# EAGLE schematic firefly-ice (EAGLE 6.4)

## Sheet 1 of 6
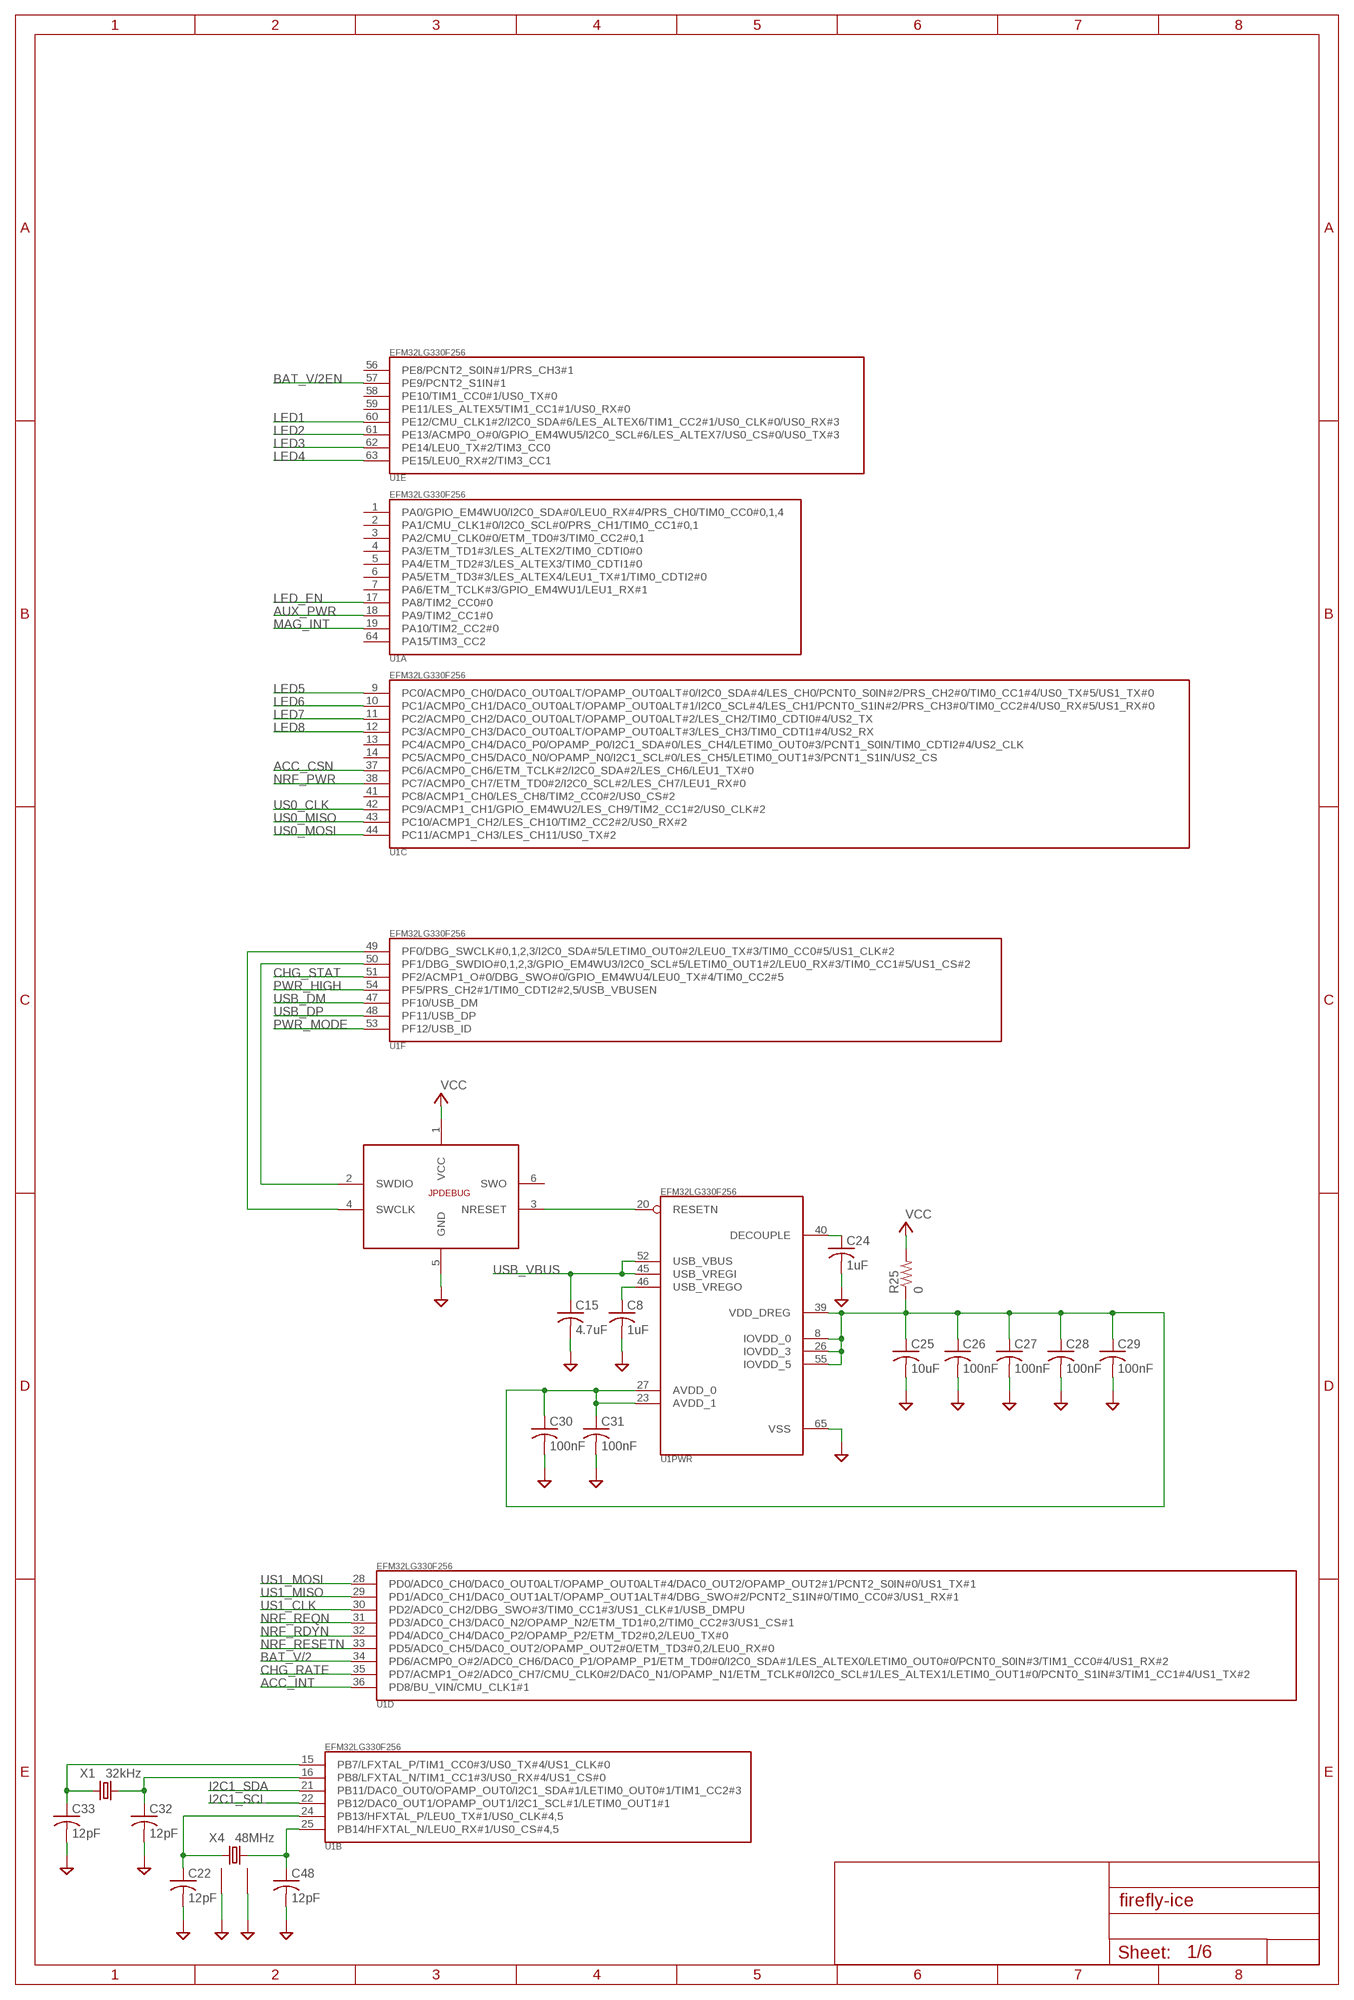
[diagram p0: schematic, sheet 1]

### Parts
C8  1uF  C-USC0201  [C0201]
C15  4.7uF  C-USC0402  [C0402]
C22  12pF  C-USC0201  [C0201]
C24  1uF  C-USC0201  [C0201]
C25  10uF  C-USC0402  [C0402]
C26  100nF  C-USC0201  [C0201]
C27  100nF  C-USC0201  [C0201]
C28  100nF  C-USC0201  [C0201]
C29  100nF  C-USC0201  [C0201]
C30  100nF  C-USC0201  [C0201]
C31  100nF  C-USC0201  [C0201]
C32  12pF  C-USC0201  [C0201]
C33  12pF  C-USC0201  [C0201]
C48  12pF  C-USC0201  [C0201]
JPDEBUG  TC2030-SWD  [TC2030-MCP-NL]
R25  0  R-US_R0603  [R0603@1]
U1  EFM32LG330F256  [QFN64]
X1  32kHz  XTAL29HT10  [9HT10]
X4  48MHz  XTALABM11  [ABM11]

### Nets
ACC_CSN: U1.37(C:PC6/ACMP0_CH6/ETM_TCLK#2/I2C0_SDA#2/LES_CH6/LEU1_TX#0) ; also sheet 3
ACC_INT: U1.36(D:PD8/BU_VIN/CMU_CLK1#1) ; also sheet 3
AUX_PWR: U1.18(A:PA9/TIM2_CC1#0) ; also sheet 4
BAT_V/2: U1.34(D:PD6/ACMP0_O#2/ADC0_CH6/DAC0_P1/OPAMP_P1/ETM_TD0#0/I2C0_SDA#1/LES_ALTEX0/LETIM0_OUT0#0/PCNT0_S0IN#3/TIM1_CC0#4/US1_RX#2) ; also sheet 6
BAT_V/2EN: U1.57(E:PE9/PCNT2_S1IN#1) ; also sheet 6
CHG_RATE: U1.35(D:PD7/ACMP1_O#2/ADC0_CH7/CMU_CLK0#2/DAC0_N1/OPAMP_N1/ETM_TCLK#0/I2C0_SCL#1/LES_ALTEX1/LETIM0_OUT1#0/PCNT0_S1IN#3/TIM1_CC1#4/US1_TX#2) ; also sheet 6
CHG_STAT: U1.51(F:PF2/ACMP1_O#0/DBG_SWO#0/GPIO_EM4WU4/LEU0_TX#4/TIM0_CC2#5) ; also sheet 6
GND: C8.2 C15.2 C22.2 C24.2 C25.2 C26.2 C27.2 C28.2 C29.2 C30.2 C31.2 C32.2 C33.2 C48.2 JPDEBUG.5(GND) U1.65(PWR:VSS) X4.2(GND1) X4.4(GND2) ; also sheet 2,3,4,5,6
I2C1_SCL: U1.22(B:PB12/DAC0_OUT1/OPAMP_OUT1/I2C1_SCL#1/LETIM0_OUT1#1) ; also sheet 4,5
I2C1_SDA: U1.21(B:PB11/DAC0_OUT0/OPAMP_OUT0/I2C1_SDA#1/LETIM0_OUT0#1/TIM1_CC2#3) ; also sheet 4,5
LED1: U1.60(E:PE12/CMU_CLK1#2/I2C0_SDA#6/LES_ALTEX6/TIM1_CC2#1/US0_CLK#0/US0_RX#3) ; also sheet 5
LED2: U1.61(E:PE13/ACMP0_O#0/GPIO_EM4WU5/I2C0_SCL#6/LES_ALTEX7/US0_CS#0/US0_TX#3) ; also sheet 5
LED3: U1.62(E:PE14/LEU0_TX#2/TIM3_CC0) ; also sheet 5
LED4: U1.63(E:PE15/LEU0_RX#2/TIM3_CC1) ; also sheet 5
LED5: U1.9(C:PC0/ACMP0_CH0/DAC0_OUT0ALT/OPAMP_OUT0ALT#0/I2C0_SDA#4/LES_CH0/PCNT0_S0IN#2/PRS_CH2#0/TIM0_CC1#4/US0_TX#5/US1_TX#0) ; also sheet 5
LED6: U1.10(C:PC1/ACMP0_CH1/DAC0_OUT0ALT/OPAMP_OUT0ALT#1/I2C0_SCL#4/LES_CH1/PCNT0_S1IN#2/PRS_CH3#0/TIM0_CC2#4/US0_RX#5/US1_RX#0) ; also sheet 5
LED7: U1.11(C:PC2/ACMP0_CH2/DAC0_OUT0ALT/OPAMP_OUT0ALT#2/LES_CH2/TIM0_CDTI0#4/US2_TX) ; also sheet 5
LED8: U1.12(C:PC3/ACMP0_CH3/DAC0_OUT0ALT/OPAMP_OUT0ALT#3/LES_CH3/TIM0_CDTI1#4/US2_RX) ; also sheet 5
LED_EN: U1.17(A:PA8/TIM2_CC0#0) ; also sheet 5
MAG_INT: U1.19(A:PA10/TIM2_CC2#0) ; also sheet 4
N$2: JPDEBUG.3(NRESET) U1.20(PWR:RESETN)
N$7: C8.1 U1.46(PWR:USB_VREGO)
N$21: C48.1 U1.25(B:PB14/HFXTAL_N/LEU0_RX#1/US0_CS#4,5) X4.3
N$23: C24.1 U1.40(PWR:DECOUPLE)
N$25: C33.1 U1.15(B:PB7/LFXTAL_P/TIM1_CC0#3/US0_TX#4/US1_CLK#0) X1.1
N$34: C22.1 U1.24(B:PB13/HFXTAL_P/LEU0_TX#1/US0_CLK#4,5) X4.1
N$35: JPDEBUG.2(SWDIO) U1.50(F:PF1/DBG_SWDIO#0,1,2,3/GPIO_EM4WU3/I2C0_SCL#5/LETIM0_OUT1#2/LEU0_RX#3/TIM0_CC1#5/US1_CS#2)
N$39: JPDEBUG.4(SWCLK) U1.49(F:PF0/DBG_SWCLK#0,1,2,3/I2C0_SDA#5/LETIM0_OUT0#2/LEU0_TX#3/TIM0_CC0#5/US1_CLK#2)
N$40: C32.1 U1.16(B:PB8/LFXTAL_N/TIM1_CC1#3/US0_RX#4/US1_CS#0) X1.2
N$42: C25.1 C26.1 C27.1 C28.1 C29.1 C30.1 C31.1 R25.1 U1.8(PWR:IOVDD_0) U1.23(PWR:AVDD_1) U1.26(PWR:IOVDD_3) U1.27(PWR:AVDD_0) U1.39(PWR:VDD_DREG) U1.55(PWR:IOVDD_5)
NRF_PWR: U1.38(C:PC7/ACMP0_CH7/ETM_TD0#2/I2C0_SCL#2/LES_CH7/LEU1_RX#0) ; also sheet 2
NRF_RDYN: U1.32(D:PD4/ADC0_CH4/DAC0_P2/OPAMP_P2/ETM_TD2#0,2/LEU0_TX#0) ; also sheet 2
NRF_REQN: U1.31(D:PD3/ADC0_CH3/DAC0_N2/OPAMP_N2/ETM_TD1#0,2/TIM0_CC2#3/US1_CS#1) ; also sheet 2
NRF_RESETN: U1.33(D:PD5/ADC0_CH5/DAC0_OUT2/OPAMP_OUT2#0/ETM_TD3#0,2/LEU0_RX#0) ; also sheet 2
PWR_HIGH: U1.54(F:PF5/PRS_CH2#1/TIM0_CDTI2#2,5/USB_VBUSEN) ; also sheet 6
PWR_MODE: U1.53(F:PF12/USB_ID) ; also sheet 6
US0_CLK: U1.42(C:PC9/ACMP1_CH1/GPIO_EM4WU2/LES_CH9/TIM2_CC1#2/US0_CLK#2) ; also sheet 3
US0_MISO: U1.43(C:PC10/ACMP1_CH2/LES_CH10/TIM2_CC2#2/US0_RX#2) ; also sheet 3
US0_MOSI: U1.44(C:PC11/ACMP1_CH3/LES_CH11/US0_TX#2) ; also sheet 3
US1_CLK: U1.30(D:PD2/ADC0_CH2/DBG_SWO#3/TIM0_CC1#3/US1_CLK#1/USB_DMPU) ; also sheet 2
US1_MISO: U1.29(D:PD1/ADC0_CH1/DAC0_OUT1ALT/OPAMP_OUT1ALT#4/DBG_SWO#2/PCNT2_S1IN#0/TIM0_CC0#3/US1_RX#1) ; also sheet 2
US1_MOSI: U1.28(D:PD0/ADC0_CH0/DAC0_OUT0ALT/OPAMP_OUT0ALT#4/DAC0_OUT2/OPAMP_OUT2#1/PCNT2_S0IN#0/US1_TX#1) ; also sheet 2
USB_DM: U1.47(F:PF10/USB_DM) ; also sheet 6
USB_DP: U1.48(F:PF11/USB_DP) ; also sheet 6
USB_VBUS: C15.1 U1.45(PWR:USB_VREGI) U1.52(PWR:USB_VBUS) ; also sheet 6
VCC: JPDEBUG.1(VCC) R25.2 ; also sheet 2,3,4,5,6
Unconnected: JPDEBUG.6(SWO) U1.1(A:PA0/GPIO_EM4WU0/I2C0_SDA#0/LEU0_RX#4/PRS_CH0/TIM0_CC0#0,1,4) U1.2(A:PA1/CMU_CLK1#0/I2C0_SCL#0/PRS_CH1/TIM0_CC1#0,1) U1.3(A:PA2/CMU_CLK0#0/ETM_TD0#3/TIM0_CC2#0,1) U1.4(A:PA3/ETM_TD1#3/LES_ALTEX2/TIM0_CDTI0#0) U1.5(A:PA4/ETM_TD2#3/LES_ALTEX3/TIM0_CDTI1#0) U1.6(A:PA5/ETM_TD3#3/LES_ALTEX4/LEU1_TX#1/TIM0_CDTI2#0) U1.7(A:PA6/ETM_TCLK#3/GPIO_EM4WU1/LEU1_RX#1) U1.13(C:PC4/ACMP0_CH4/DAC0_P0/OPAMP_P0/I2C1_SDA#0/LES_CH4/LETIM0_OUT0#3/PCNT1_S0IN/TIM0_CDTI2#4/US2_CLK) U1.14(C:PC5/ACMP0_CH5/DAC0_N0/OPAMP_N0/I2C1_SCL#0/LES_CH5/LETIM0_OUT1#3/PCNT1_S1IN/US2_CS) U1.41(C:PC8/ACMP1_CH0/LES_CH8/TIM2_CC0#2/US0_CS#2) U1.56(E:PE8/PCNT2_S0IN#1/PRS_CH3#1) U1.58(E:PE10/TIM1_CC0#1/US0_TX#0) U1.59(E:PE11/LES_ALTEX5/TIM1_CC1#1/US0_RX#0) U1.64(A:PA15/TIM3_CC2)

## Sheet 2 of 6
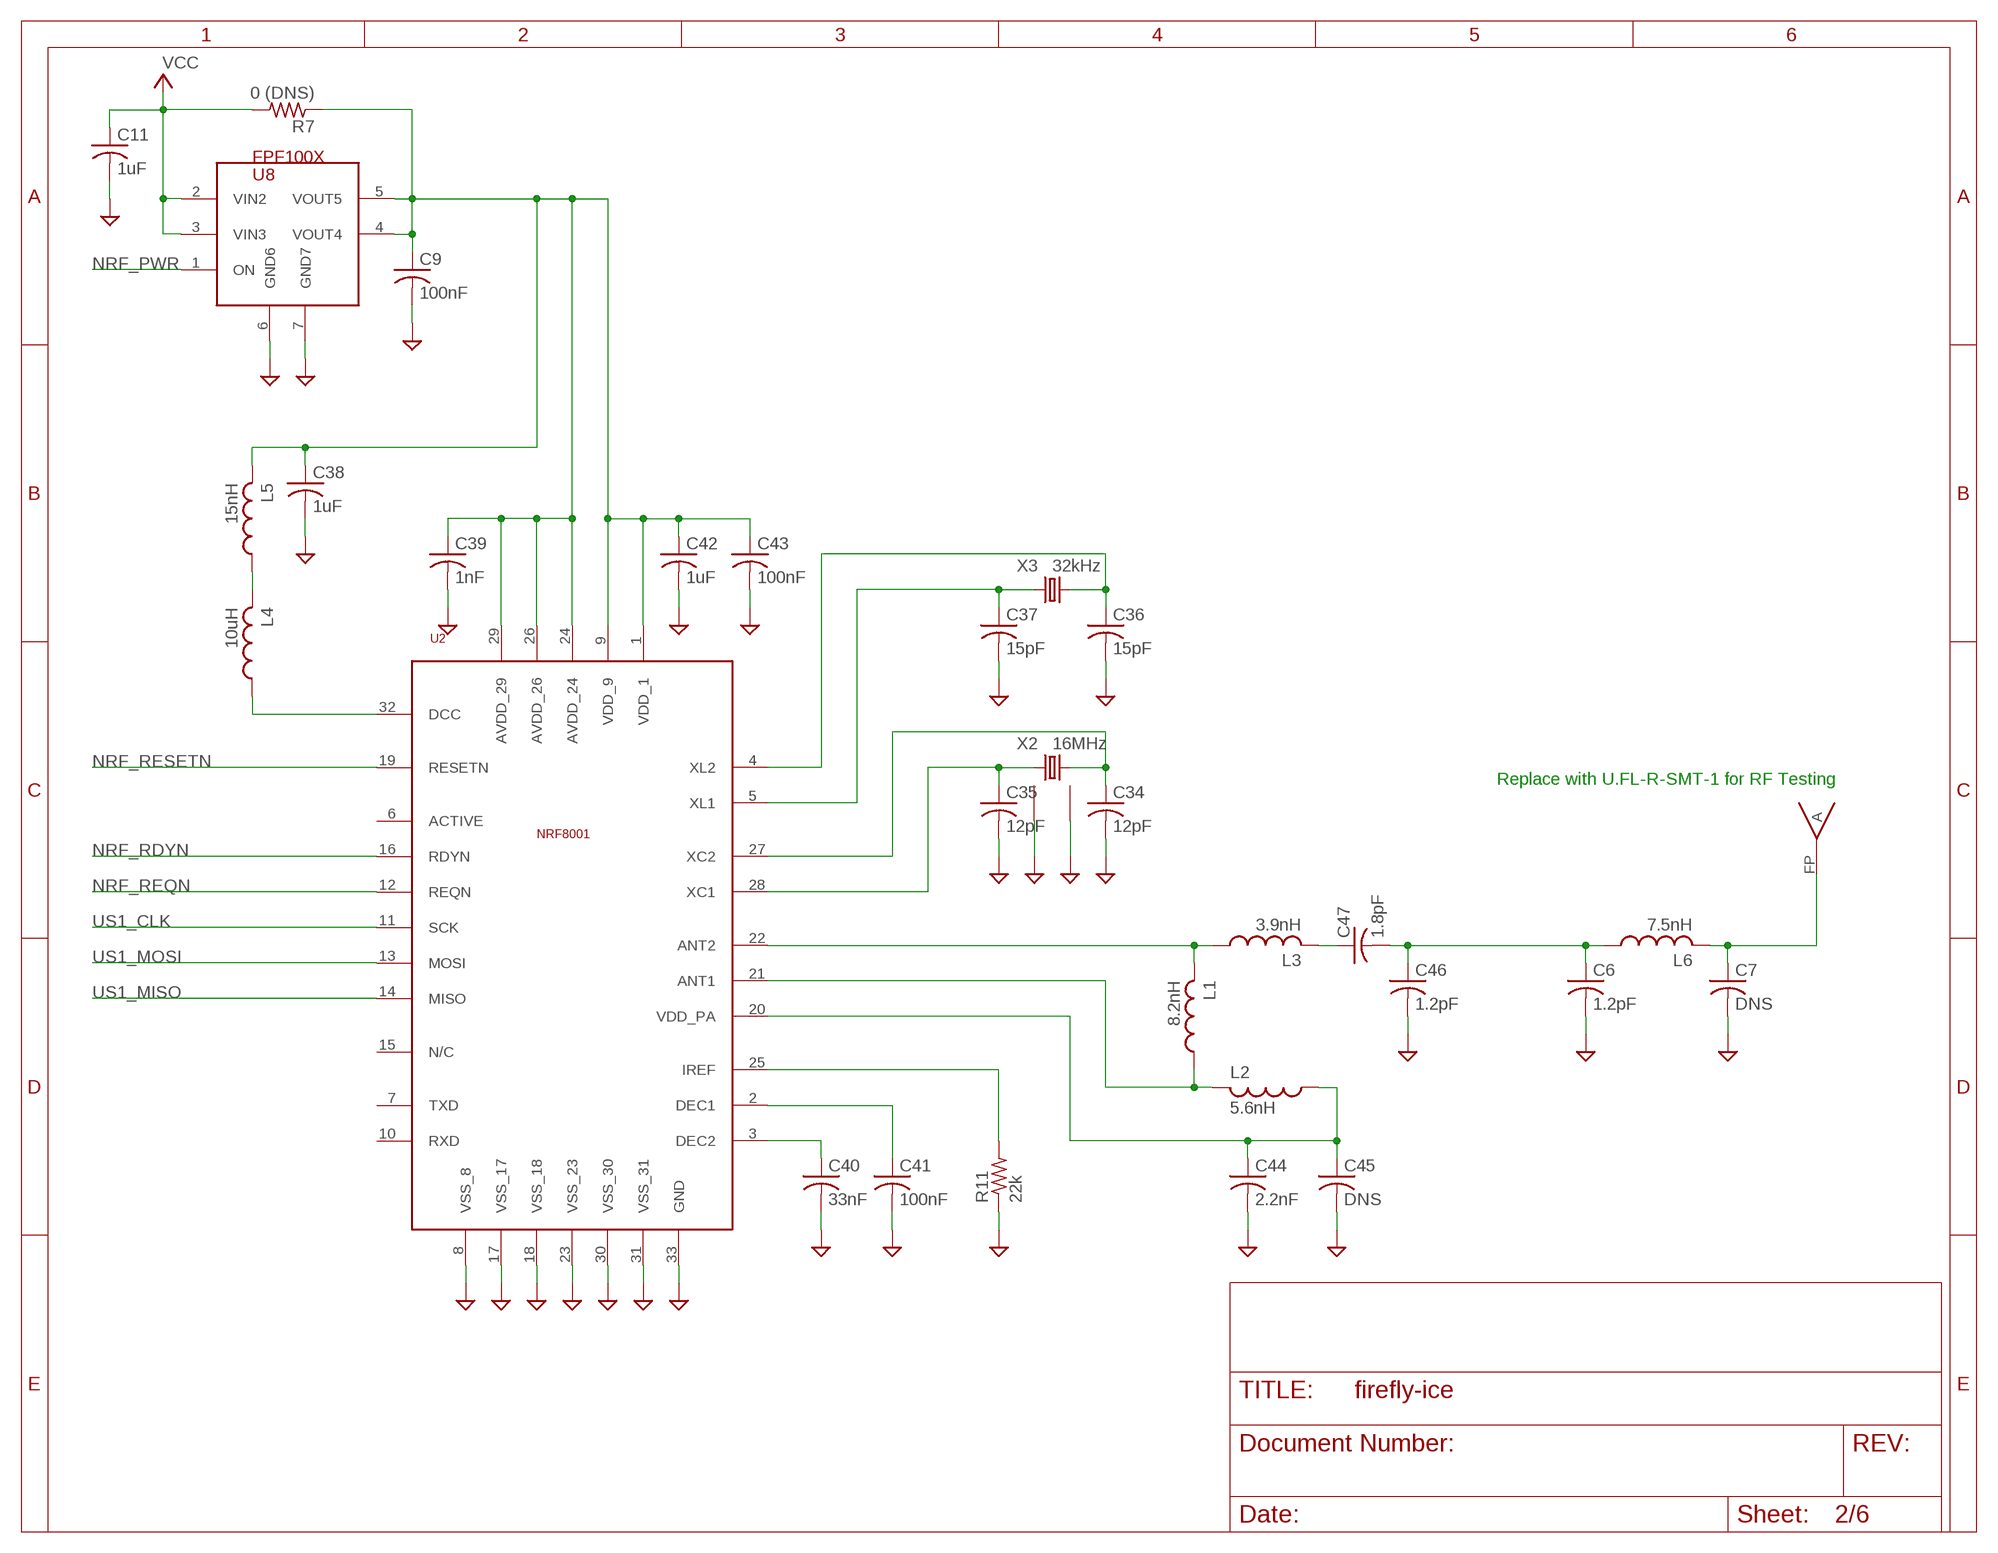
[diagram p1: schematic, sheet 2]

### Parts
A1  FR05_S1_N_0_110  [FR05_S1_N_0_110]
C6  1.2pF  C-USC0201  [C0201]
C7  DNS  C-USC0201  [C0201]
C9  100nF  C-USC0201  [C0201]
C11  1uF  C-USC0201  [C0201]
C34  12pF  C-USC0201  [C0201]
C35  12pF  C-USC0201  [C0201]
C36  15pF  C-USC0201  [C0201]
C37  15pF  C-USC0201  [C0201]
C38  1uF  C-USC0201  [C0201]
C39  1nF  C-USC0201  [C0201]
C40  33nF  C-USC0201  [C0201]
C41  100nF  C-USC0201  [C0201]
C42  1uF  C-USC0201  [C0201]
C43  100nF  C-USC0201  [C0201]
C44  2.2nF  C-USC0201  [C0201]
C45  DNS  C-USC0201  [C0201]
C46  1.2pF  C-USC0201  [C0201]
C47  1.8pF  C-USC0201  [C0201]
L1  8.2nH  L-USL0201  [L0201]
L2  5.6nH  L-USL0201  [L0201]
L3  3.9nH  L-USL0201  [L0201]
L4  10uH  INDUCTOR0603  [0603]
L5  15nH  L-USL0201  [L0201]
L6  7.5nH  L-USL0201  [L0201]
R7  0 (DNS)  R-US_R0201  [R0201]
R11  22k  R-US_R0201  [R0201]
U2  NRF8001  [QFN-32]
U8  FPF100X  [MICROFET-2X2-6L]
X2  16MHz  XTALTSX-3225  [TSX-3225]
X3  32kHz  XTAL29HT10  [9HT10]

### Nets
GND: C6.2 C7.2 C9.2 C11.2 C34.2 C35.2 C36.2 C37.2 C38.2 C39.2 C40.2 C41.2 C42.2 C43.2 C44.2 C45.2 C46.2 R11.1 U2.8(VSS_8) U2.17(VSS_17) U2.18(VSS_18) U2.23(VSS_23) U2.30(VSS_30) U2.31(VSS_31) U2.33(GND) U8.6(GND6) U8.7(GND7) X2.2(GND1) X2.4(GND2) ; also sheet 1,3,4,5,6
N$1: A1.FP(A) C7.1 L6.2
N$8: C9.1 C38.1 C39.1 C42.1 C43.1 L5.2 R7.1 U2.1(VDD_1) U2.9(VDD_9) U2.24(AVDD_24) U2.26(AVDD_26) U2.29(AVDD_29) U8.4(VOUT4) U8.5(VOUT5)
N$16: C35.1 U2.28(XC1) X2.1
N$17: C34.1 U2.27(XC2) X2.3
N$18: C37.1 U2.5(XL1) X3.1
N$27: C36.1 U2.4(XL2) X3.2
N$36: R11.2 U2.25(IREF)
N$43: C40.1 U2.3(DEC2)
N$49: C41.1 U2.2(DEC1)
N$50: C47.1 L3.2
N$51: C6.1 C46.1 C47.2 L6.1
N$52: C44.1 C45.1 L2.1 U2.20(VDD_PA)
N$53: L1.1 L2.2 U2.21(ANT1)
N$54: L1.2 L3.1 U2.22(ANT2)
N$55: L4.1 U2.32(DCC)
N$56: L4.2 L5.1
NRF_PWR: U8.1(ON) ; also sheet 1
NRF_RDYN: U2.16(RDYN) ; also sheet 1
NRF_REQN: U2.12(REQN) ; also sheet 1
NRF_RESETN: U2.19(RESETN) ; also sheet 1
US1_CLK: U2.11(SCK) ; also sheet 1
US1_MISO: U2.14(MISO) ; also sheet 1
US1_MOSI: U2.13(MOSI) ; also sheet 1
VCC: C11.1 R7.2 U8.2(VIN2) U8.3(VIN3) ; also sheet 1,3,4,5,6
Unconnected: U2.6(ACTIVE) U2.7(TXD) U2.10(RXD) U2.15(N/C)

### Notes on the sheet
- Replace with U.FL-R-SMT-1 for RF Testing

## Sheet 3 of 6
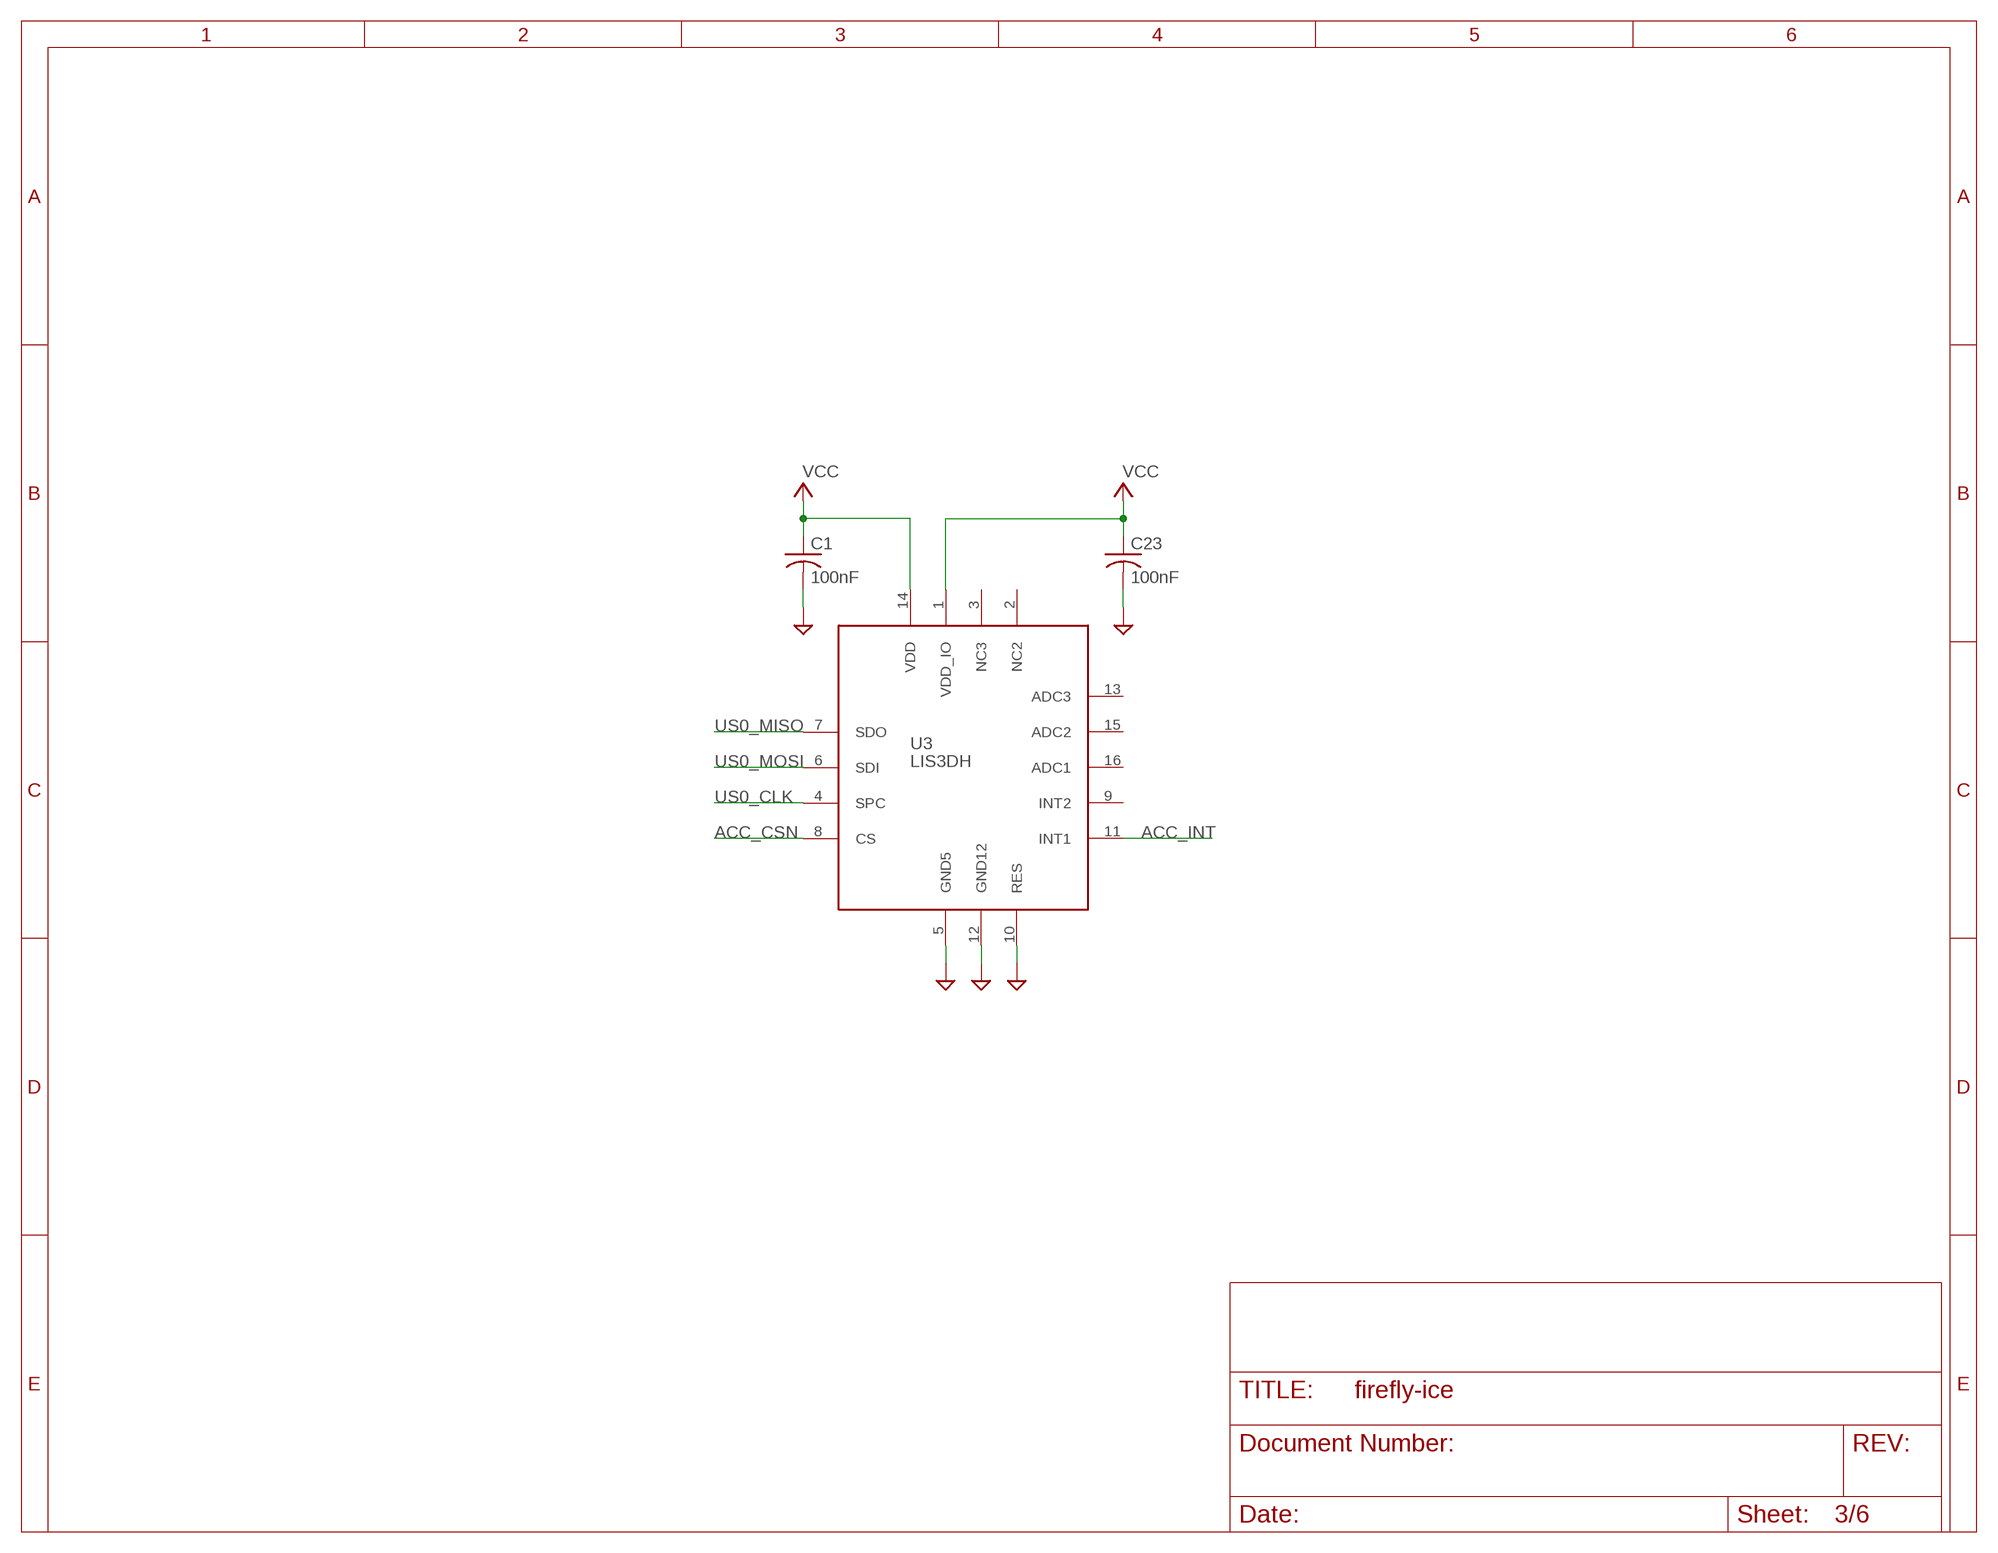
[diagram p2: schematic, sheet 3]

### Parts
C1  100nF  C-USC0201  [C0201]
C23  100nF  C-USC0201  [C0201]
U3  LIS3DH  [LGA16_3X3]

### Nets
ACC_CSN: U3.8(CS) ; also sheet 1
ACC_INT: U3.11(INT1) ; also sheet 1
GND: C1.2 C23.2 U3.5(GND5) U3.10(RES) U3.12(GND12) ; also sheet 1,2,4,5,6
US0_CLK: U3.4(SPC) ; also sheet 1
US0_MISO: U3.7(SDO) ; also sheet 1
US0_MOSI: U3.6(SDI) ; also sheet 1
VCC: C1.1 C23.1 U3.1(VDD_IO) U3.14(VDD) ; also sheet 1,2,4,5,6
Unconnected: U3.2(NC2) U3.3(NC3) U3.9(INT2) U3.13(ADC3) U3.15(ADC2) U3.16(ADC1)

## Sheet 4 of 6
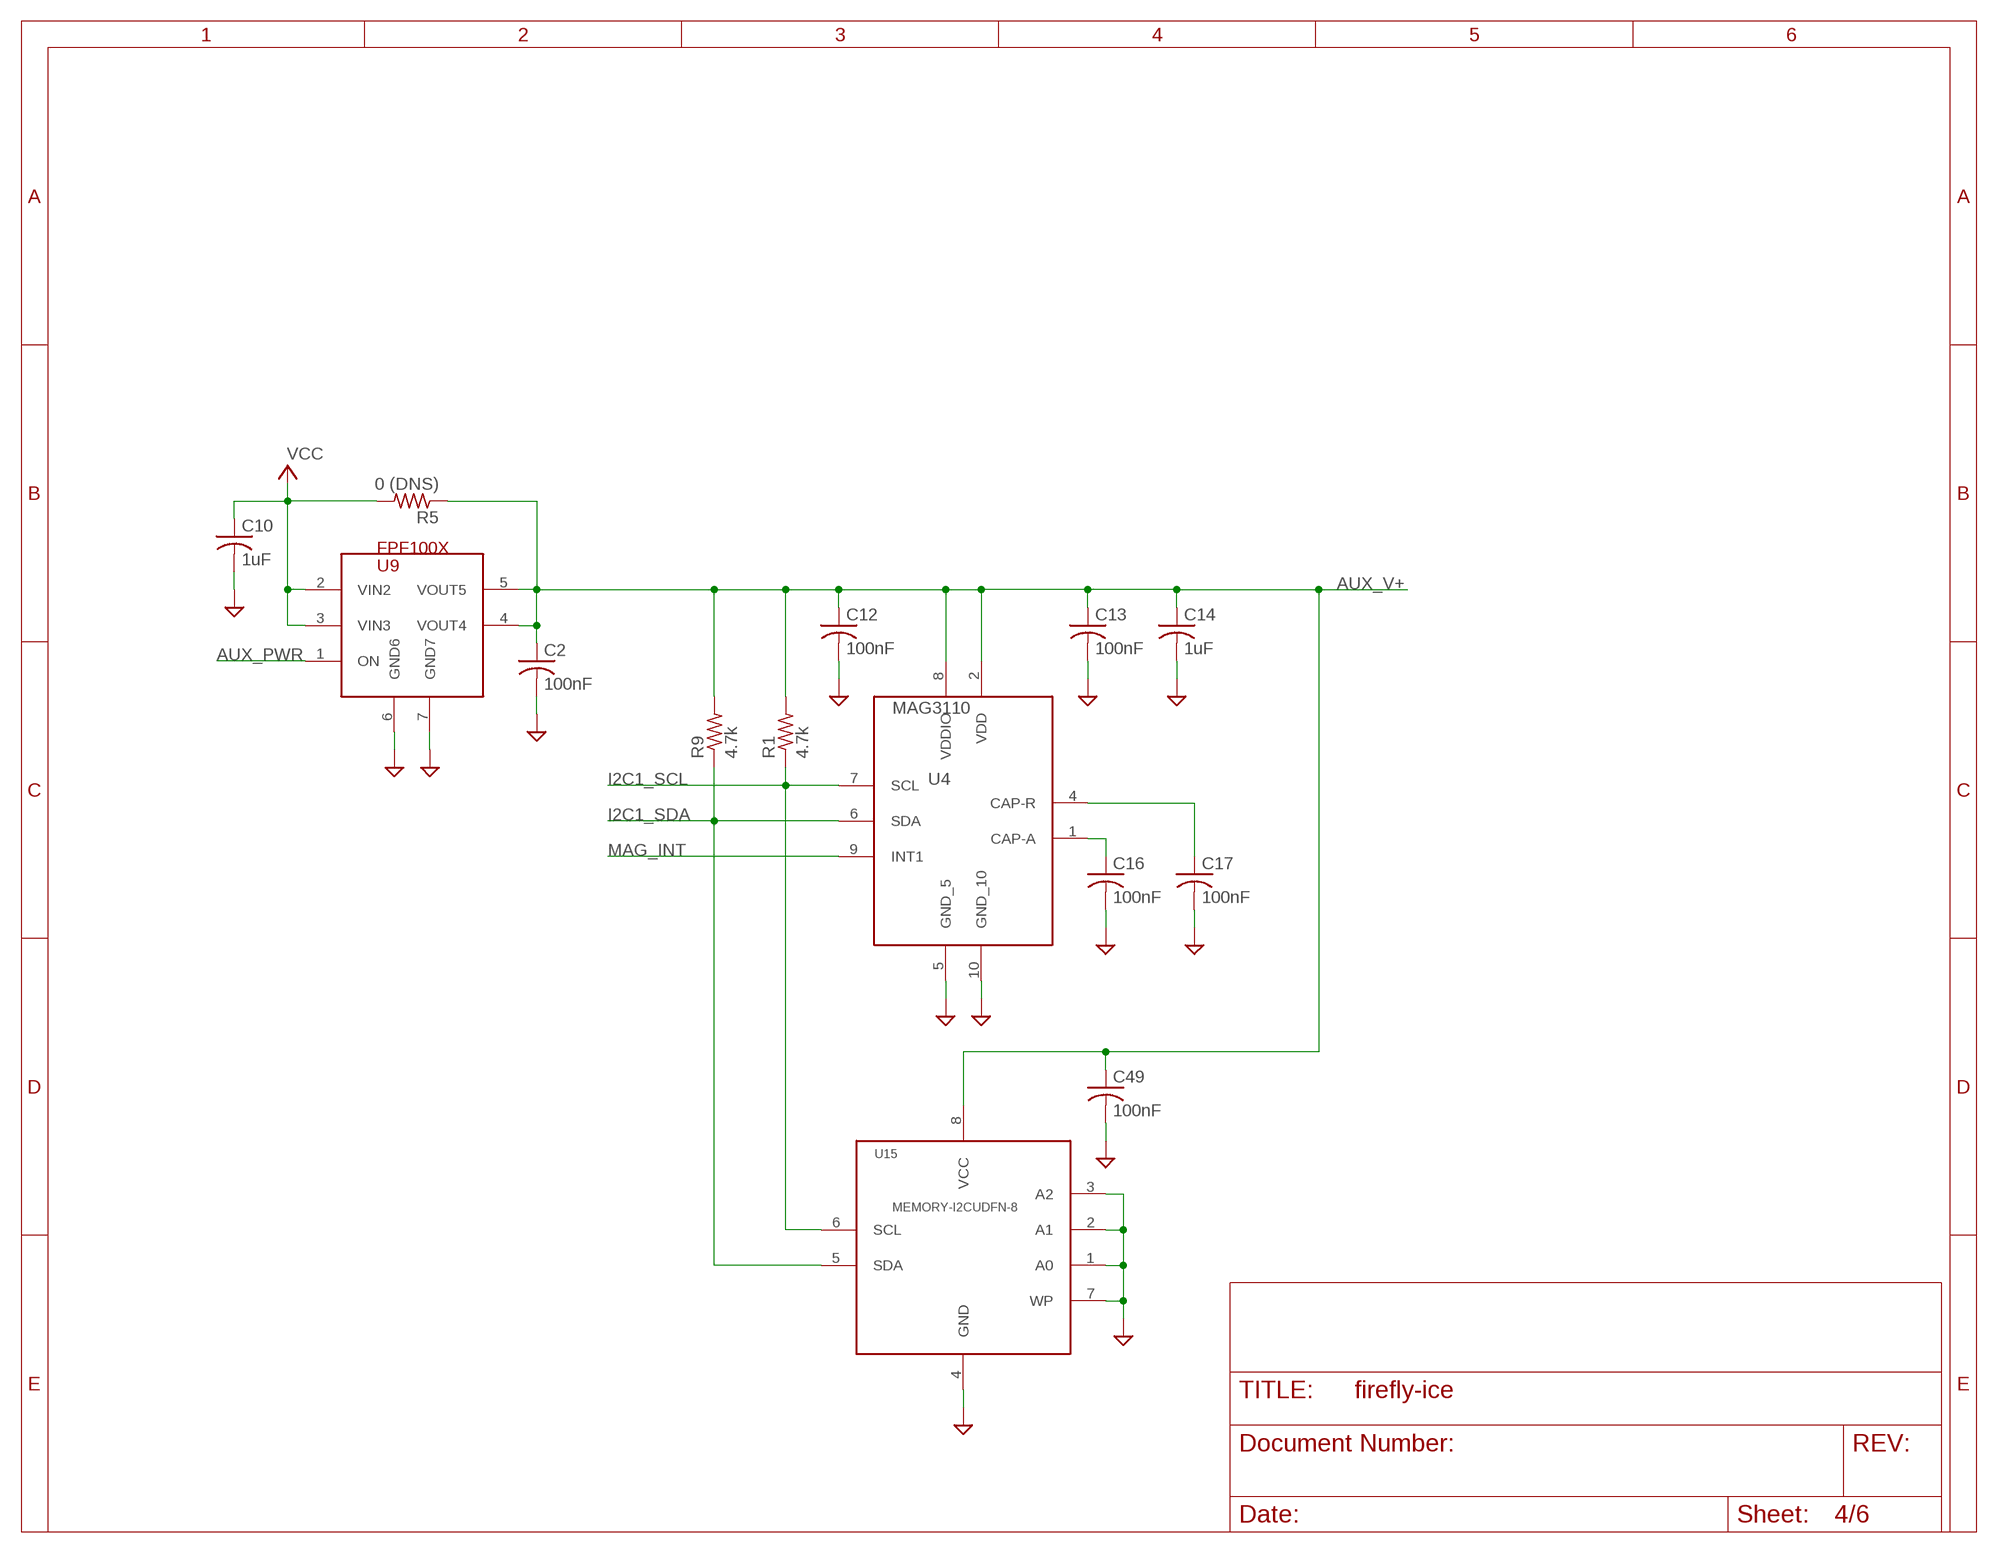
[diagram p3: schematic, sheet 4]

### Parts
C2  100nF  C-USC0201  [C0201]
C10  1uF  C-USC0201  [C0201]
C12  100nF  C-USC0201  [C0201]
C13  100nF  C-USC0201  [C0201]
C14  1uF  C-USC0201  [C0201]
C16  100nF  C-USC0201  [C0201]
C17  100nF  C-USC0201  [C0201]
C49  100nF  C-USC0201  [C0201]
R1  4.7k  R-US_R0201  [R0201]
R5  0 (DNS)  R-US_R0201  [R0201]
R9  4.7k  R-US_R0201  [R0201]
U4  MAG3110  [DFN10-2X2]
U9  FPF100X  [MICROFET-2X2-6L]
U15  MEMORY-I2CUDFN-8  [UDFN-8]

### Nets
AUX_PWR: U9.1(ON) ; also sheet 1
AUX_V+: C2.1 C12.1 C13.1 C14.1 C49.1 R1.2 R5.1 R9.2 U4.2(VDD) U4.8(VDDIO) U9.4(VOUT4) U9.5(VOUT5) U15.8(VCC) ; also sheet 5
GND: C2.2 C10.2 C12.2 C13.2 C14.2 C16.2 C17.2 C49.2 U4.5(GND_5) U4.10(GND_10) U9.6(GND6) U9.7(GND7) U15.1(A0) U15.2(A1) U15.3(A2) U15.4(GND) U15.7(WP) ; also sheet 1,2,3,5,6
I2C1_SCL: R1.1 U4.7(SCL) U15.6(SCL) ; also sheet 1,5
I2C1_SDA: R9.1 U4.6(SDA) U15.5(SDA) ; also sheet 1,5
MAG_INT: U4.9(INT1) ; also sheet 1
N$32: C16.1 U4.1(CAP-A)
N$33: C17.1 U4.4(CAP-R)
VCC: C10.1 R5.2 U9.2(VIN2) U9.3(VIN3) ; also sheet 1,2,3,5,6

## Sheet 5 of 6
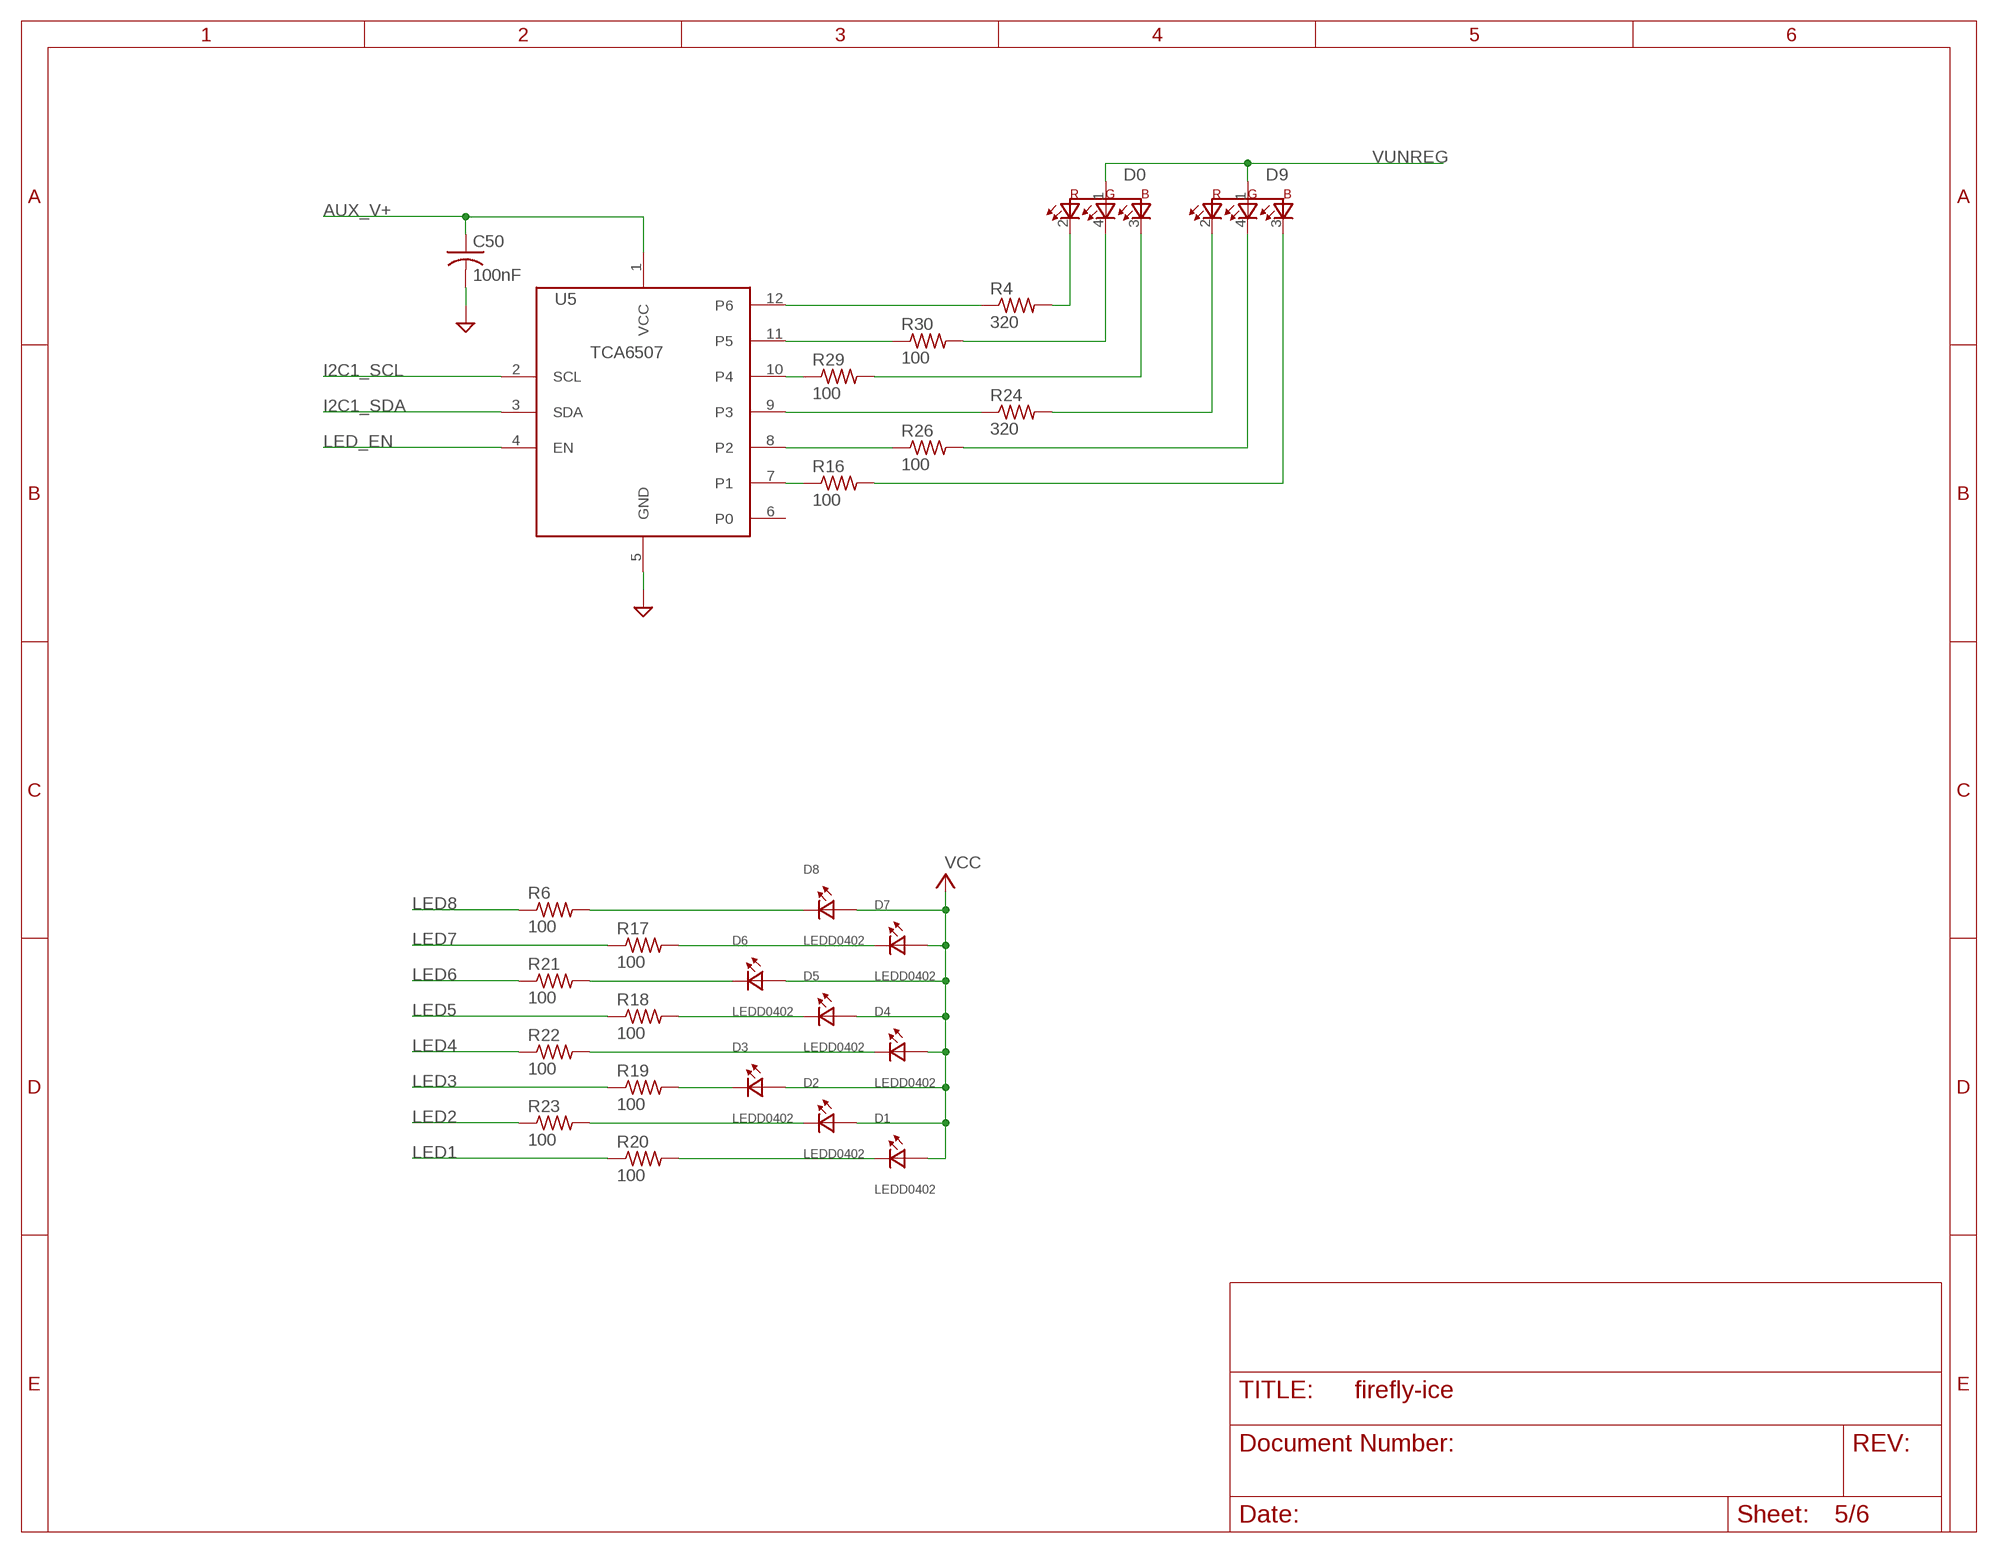
[diagram p4: schematic, sheet 5]

### Parts
C50  100nF  C-USC0201  [C0201]
D0  LED-RGB-CASMLP34  [SMLP34]
D1  LEDD0402  [D0402]
D2  LEDD0402  [D0402]
D3  LEDD0402  [D0402]
D4  LEDD0402  [D0402]
D5  LEDD0402  [D0402]
D6  LEDD0402  [D0402]
D7  LEDD0402  [D0402]
D8  LEDD0402  [D0402]
D9  LED-RGB-CASMLP34  [SMLP34]
R4  320  R-US_R0201  [R0201]
R6  100  R-US_R0201  [R0201]
R16  100  R-US_R0201  [R0201]
R17  100  R-US_R0201  [R0201]
R18  100  R-US_R0201  [R0201]
R19  100  R-US_R0201  [R0201]
R20  100  R-US_R0201  [R0201]
R21  100  R-US_R0201  [R0201]
R22  100  R-US_R0201  [R0201]
R23  100  R-US_R0201  [R0201]
R24  320  R-US_R0201  [R0201]
R26  100  R-US_R0201  [R0201]
R29  100  R-US_R0201  [R0201]
R30  100  R-US_R0201  [R0201]
U5  TCA6507  [R-PX2QFN-N12]

### Nets
AUX_V+: C50.1 U5.1(VCC) ; also sheet 4
D0: D0.4(G) R30.2
GND: C50.2 U5.5(GND) ; also sheet 1,2,3,4,6
I2C1_SCL: U5.2(SCL) ; also sheet 1,4
I2C1_SDA: U5.3(SDA) ; also sheet 1,4
LED1: R20.1 ; also sheet 1
LED2: R23.1 ; also sheet 1
LED3: R19.1 ; also sheet 1
LED4: R22.1 ; also sheet 1
LED5: R18.1 ; also sheet 1
LED6: R21.1 ; also sheet 1
LED7: R17.1 ; also sheet 1
LED8: R6.1 ; also sheet 1
LED_EN: U5.4(EN) ; also sheet 1
N$5: R24.1 U5.9(P3)
N$6: R29.1 U5.10(P4)
N$9: D8.C R6.2
N$10: D7.C R17.2
N$11: D6.C R21.2
N$12: D5.C R18.2
N$13: D4.C R22.2
N$14: D3.C R19.2
N$15: D2.C R23.2
N$19: D1.C R20.2
N$20: R4.1 U5.12(P6)
N$37: R16.1 U5.7(P1)
N$41: R26.1 U5.8(P2)
N$44: R30.1 U5.11(P5)
N$46: D0.3(B) R29.2
N$47: D9.4(G) R26.2
N$48: D9.3(B) R16.2
N$57: D0.2(R) R4.2
N$58: D9.2(R) R24.2
VCC: D1.A D2.A D3.A D4.A D5.A D6.A D7.A D8.A ; also sheet 1,2,3,4,6
VUNREG: D0.1(A) D9.1(A) ; also sheet 6
Unconnected: U5.6(P0)

## Sheet 6 of 6
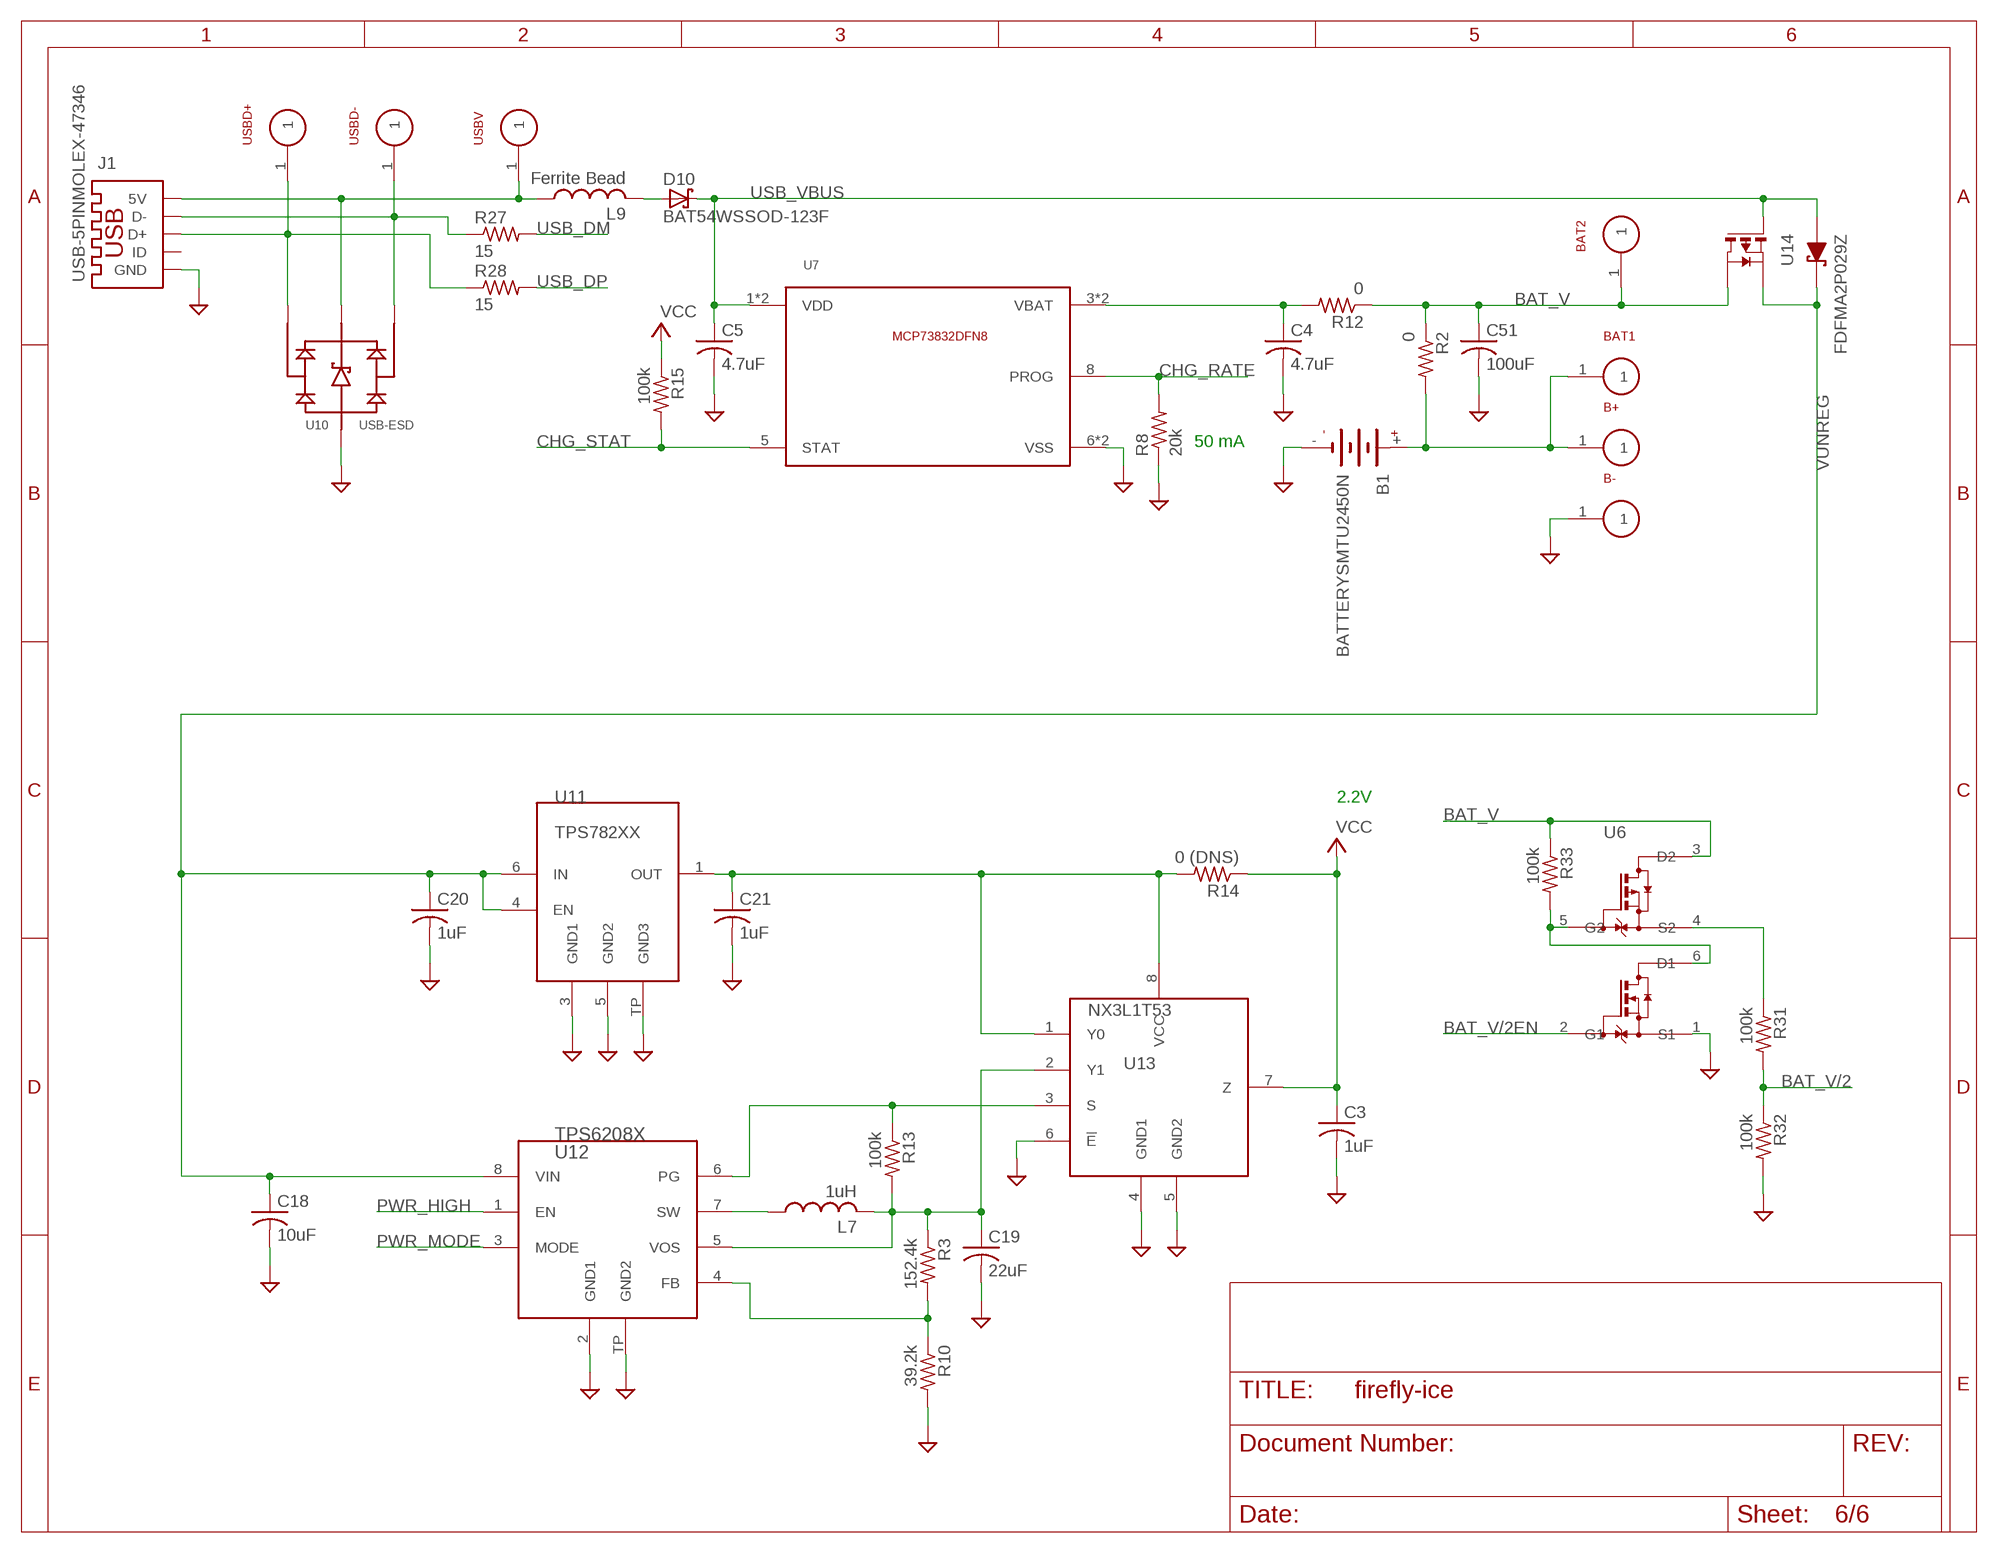
[diagram p5: schematic, sheet 6]

### Parts
B1  BATTERYSMTU2450N  [SMTU2450N]
B+  TARGET-PINWP-28AWG  [WP-28AWG]
B-  TARGET-PINWP-28AWG  [WP-28AWG]
BAT1  TARGET-PIN  [TARGET-PIN-1MM]
BAT2  TARGET-PIN  [TARGET-PIN-1MM]
C3  1uF  C-USC0201  [C0201]
C4  4.7uF  C-USC0402  [C0402]
C5  4.7uF  C-USC0402  [C0402]
C18  10uF  C-USC0402  [C0402]
C19  22uF  C-USC0603  [C0603]
C20  1uF  C-USC0201  [C0201]
C21  1uF  C-USC0201  [C0201]
C51  100uF  C-USC1206  [C1206]
D10  BAT54WSSOD-123F  [SOD-123F]
J1  USB-5PINMOLEX-47346  [MOLEX-47346]
L7  1uH  INDUCTORL0805  [L0805]
L9  Ferrite Bead  L-USL0402  [L0402]
R2  0  R-US_R0603  [R0603@1]
R3  152.4k  R-US_R0201  [R0201]
R8  20k  R-US_R0201  [R0201]
R10  39.2k  R-US_R0201  [R0201]
R12  0  R-US_R0603  [R0603@1]
R13  100k  R-US_R0201  [R0201]
R14  0 (DNS)  R-US_R0201  [R0201]
R15  100k  R-US_R0201  [R0201]
R27  15  R-US_R0201  [R0201]
R28  15  R-US_R0201  [R0201]
R31  100k  R-US_R0201  [R0201]
R32  100k  R-US_R0201  [R0201]
R33  100k  R-US_R0201  [R0201]
U6  MOSFET-N+PSOT963  [SOT963]
U7  MCP73832DFN8  [DFN8]
U10  USB-ESD  [UQFN6]
U11  TPS782XX  [S-PWSON-N6]
U12  TPS6208X  [S-PWSON-N8]
U13  NX3L1T53  [SOT902-2]
U14  FDFMA2P029Z  [MO-229]
USBD+  TARGET-PIN  [TARGET-PIN-1MM]
USBD-  TARGET-PIN  [TARGET-PIN-1MM]
USBV  TARGET-PIN  [TARGET-PIN-1MM]

### Nets
BAT_V: BAT2.1 C51.1 R2.1 R12.1 R33.1 U6.3(D2) U14.4(S)
BAT_V/2: R31.2 R32.1 ; also sheet 1
BAT_V/2EN: U6.2(G1) ; also sheet 1
CHG_RATE: R8.2 U7.8(PROG) ; also sheet 1
CHG_STAT: R15.2 U7.5(STAT) ; also sheet 1
GND: B1.- B-.1 C3.2 C4.2 C5.2 C18.2 C19.2 C20.2 C21.2 C51.2 J1.5(GND) J1.G1(GND) J1.G2(GND) J1.G3(GND) J1.G4(GND) J1.G5(GND) J1.G6(GND) R8.1 R10.2 R32.2 U6.1(S1) U7.6(VSS) U7.PGND(VSS) U10.2(GND) U11.3(GND1) U11.5(GND2) U11.TP(GND3) U12.2(GND1) U12.TP(GND2) U13.4(GND1) U13.5(GND2) U13.6(!E) ; also sheet 1,2,3,4,5
N$3: C4.1 R12.2 U7.3(VBAT) U7.4(VBAT)
N$4: R3.2 R10.1 U12.4(FB)
N$22: J1.3(D+) R28.1 U10.1(IO1) U10.6(IO1) USBD+.1
N$24: L7.1 U12.7(SW)
N$26: R13.1 U12.6(PG) U13.3(S)
N$28: C19.1 L7.2 R3.1 R13.2 U12.5(VOS) U13.2(Y1)
N$29: C21.1 R14.2 U11.1(OUT) U13.1(Y0) U13.8(VCC)
N$30: D10.A L9.2
N$31: J1.2(D-) R27.1 U10.3(IO2) U10.4(IO2) USBD-.1
N$38: J1.1(5V) L9.1 U10.5(VBUS) USBV.1
N$45: R33.2 U6.5(G2) U6.6(D1)
N$60: R31.1 U6.4(S2)
PWR_HIGH: U12.1(EN) ; also sheet 1
PWR_MODE: U12.3(MODE) ; also sheet 1
USB_DM: R27.2 ; also sheet 1
USB_DP: R28.2 ; also sheet 1
USB_VBUS: C5.1 D10.C U7.1(VDD) U7.2(VDD) U14.1(A) U14.5(G) ; also sheet 1
VBATT: B1.+ B+.1 BAT1.1 R2.2
VCC: C3.1 R14.1 R15.1 U13.7(Z) ; also sheet 1,2,3,4,5
VUNREG: C18.1 C20.1 U11.4(EN) U11.6(IN) U12.8(VIN) U14.3(D) U14.6(C) U14.C U14.D ; also sheet 5
Unconnected: J1.4(ID)

### Notes on the sheet
- 50 mA
- 2.2V

## Library data of the parts
A1 = firefly:FR05_S1_N_0_110; DISTRIBUTOR: RichardsonRFPD; MANUFACTURER: Fractus; ORDERING-CODE: FR05_S1_N_0_110
B1 = firefly:BATTERY; MANUFACTURER: Memory Protection Devices; ORDERING-CODE: BHSD-2032-SM
B+ B- BAT1 BAT2 USBD+ USBD- USBV = firefly:TARGET-PIN
C1 C12 C13 C16 C17 C23 C26-C31 C43 C49 C50 = firefly:C-US: CAPACITOR, American symbol; MANUFACTURER: Murata; ORDERING-CODE: GRM033R60J104KE19D
C2 C9 = firefly:C-US: CAPACITOR, American symbol; MANUFACTURER: Murata; ORDERING-CODE: GRM033R60J104KE19D; VARIANTS: low-power
C3 = firefly:C-US: CAPACITOR, American symbol; MANUFACTURER: TDK Corporation; ORDERING-CODE: C0603X5R0J105M030BC; VARIANTS: efficient-power
C4 C15 = firefly:C-US: CAPACITOR, American symbol; MANUFACTURER: TDK Corporation; ORDERING-CODE: C1005X5R0J475M
C5 = firefly:C-US: CAPACITOR, American symbol; MANUFACTURER: TDK Corporation; ORDERING-CODE: C1005X5R0J475M; VARIANTS: usb-charging
C6 C46 = firefly:C-US: CAPACITOR, American symbol; MANUFACTURER: TDK; ORDERING-CODE: C0603C0G1E1R2BTQ
C7 C45 = firefly:C-US: CAPACITOR, American symbol; DNS: true
C8 C14 C20 C21 C24 C42 = firefly:C-US: CAPACITOR, American symbol; MANUFACTURER: TDK Corporation; ORDERING-CODE: C0603X5R0J105M030BC
C10 C11 = firefly:C-US: CAPACITOR, American symbol; MANUFACTURER: TDK Corporation; ORDERING-CODE: C0603X5R0J105M030BC; VARIANTS: low-power
C18 = firefly:C-US: CAPACITOR, American symbol; MANUFACTURER: TDK Corporation; ORDERING-CODE: C1005X5R0J106M050BC; VARIANTS: efficient-power
C19 = firefly:C-US: CAPACITOR, American symbol; MANUFACTURER: TDK Corporation; ORDERING-CODE: C1608X5R0J226M080AC; VARIANTS: efficient-power
C22 C48 = firefly:C-US: CAPACITOR, American symbol; MANUFACTURER: Kemet; ORDERING-CODE: CBR02C120F3GAC; VARIANTS: usb-data
C25 = firefly:C-US: CAPACITOR, American symbol; MANUFACTURER: TDK Corporation; ORDERING-CODE: C1005X5R0J106M050BC
C32-C35 = firefly:C-US: CAPACITOR, American symbol; MANUFACTURER: Kemet; ORDERING-CODE: CBR02C120F3GAC
C36 C37 = firefly:C-US: CAPACITOR, American symbol; MANUFACTURER: Kemet; ORDERING-CODE: CBR02C150F3GAC
C38 = firefly:C-US: CAPACITOR, American symbol; MANUFACTURER: TDK Corporation; ORDERING-CODE: C0603X5R0J105M030BC; VARIANTS: efficient-radio
C39 = firefly:C-US: CAPACITOR, American symbol; MANUFACTURER: Murata; ORDERING-CODE: C0603X7R1E102K
C40 = firefly:C-US: CAPACITOR, American symbol; MANUFACTURER: Murata; ORDERING-CODE: GRM033R60J333KE01D
C41 = firefly:C-US: CAPACITOR, American symbol; MANUFACTURER: Kemet; ORDERING-CODE: GRM033R60J104KE19D
C44 = firefly:C-US: CAPACITOR, American symbol; MANUFACTURER: TDK; ORDERING-CODE: C0603X5R1E222K
C47 = firefly:C-US: CAPACITOR, American symbol; MANUFACTURER: TDK; ORDERING-CODE: C0603C0G1E1R8CTQ
C51 = firefly:C-US: CAPACITOR, American symbol; MANUFACTURER: Kemet; ORDERING-CODE: C1206C107M9PACTU
D0 D9 = firefly:LED-RGB-CA; MANUFACTURER: ROHM Semiconductor; ORDERING-CODE: SMLP34RGB2W3
D1-D8 = firefly:LED; MANUFACTURER: Rohm Semiconductor; ORDERING-CODE: SML-P11UTT86
D10 = firefly:BAT54WS; MANUFACTURER: Rohm Semiconductor; ORDERING-CODE: RB161M-20TR; VARIANTS: usb-power
J1 = firefly:USB-5PIN; ALT-ORDERING-CODE: 47346-1001; MANUFACTURER: Molex; ORDERING-CODE: 0473460001; VARIANTS: usb-power
JPDEBUG = firefly:TC2030-SWD: Cortex-M Serial Wire Debug Connector; DNS: true
L1 = firefly:L-US: INDUCTOR, American symbol; MANUFACTURER: TDK; ORDERING-CODE: MLG0603P8N2J
L2 = firefly:L-US: INDUCTOR, American symbol; MANUFACTURER: TDK; ORDERING-CODE: MLG0603P5N6S
L3 = firefly:L-US: INDUCTOR, American symbol; MANUFACTURER: TDK; ORDERING-CODE: MLG0603S3N9S
L4 = firefly:INDUCTOR; MANUFACTURER: TDK; ORDERING-CODE: MLZ1608N100L; VARIANTS: efficient-radio
L5 = firefly:L-US: INDUCTOR, American symbol; MANUFACTURER: TDK; ORDERING-CODE: MLG0603S15NJ; VARIANTS: efficient-radio
L6 = firefly:L-US: INDUCTOR, American symbol; MANUFACTURER: Taiyo Yuden; ORDERING-CODE: HKQ0603S7N5H-T
L7 = firefly:INDUCTOR; MANUFACTURER: WURTH; ORDERING-CODE: 74479775210; VARIANTS: efficient-power
L9 = firefly:L-US: INDUCTOR, American symbol; MANUFACTURER: Wurth; ORDERING-CODE: 742792701; VARIANTS: usb-power
R1 R9 = firefly:R-US_: RESISTOR, American symbol; MANUFACTURER: Panasonic Electronic Components; ORDERING-CODE: ERJ-1GEF4701C
R2 R12 R25 = firefly:R-US_: RESISTOR, American symbol; MANUFACTURER: Panasonic Electronic Components; ORDERING-CODE: ERJ-3GEY0R00V
R3 = firefly:R-US_: RESISTOR, American symbol; MANUFACTURER: Panasonic Electronic Components; ORDERING-CODE: ERJ-1GEF1503C; VARIANTS: efficient-power
R4 R24 = firefly:R-US_: RESISTOR, American symbol; MANUFACTURER: Panasonic Electronic Components; ORDERING-CODE: ERJ-1GEF3240C
R5 R7 = firefly:R-US_: RESISTOR, American symbol; MANUFACTURER: Panasonic Electronic Components; ORDERING-CODE: ERJ-1GE0R00C; VARIANTS: !low-power
R6 R16-R23 R26 R29 R30 = firefly:R-US_: RESISTOR, American symbol; MANUFACTURER: Panasonic Electronic Components; ORDERING-CODE: ERJ-1GEF1000C
R8 = firefly:R-US_: RESISTOR, American symbol; MANUFACTURER: Panasonic Electronic Components; ORDERING-CODE: ERJ-1GEF2002C; VARIANTS: usb-charging
R10 = firefly:R-US_: RESISTOR, American symbol; MANUFACTURER: Panasonic Electronic Components; ORDERING-CODE: ERJ-1GEF3922C; VARIANTS: efficient-power
R11 = firefly:R-US_: RESISTOR, American symbol; MANUFACTURER: Panasonic; ORDERING-CODE: ERJ-1GEF2202C
R13 R31-R33 = firefly:R-US_: RESISTOR, American symbol; MANUFACTURER: Yageo; ORDERING-CODE: RC0201FR-07100KL; VARIANTS: efficient-power
R14 = firefly:R-US_: RESISTOR, American symbol; MANUFACTURER: Panasonic Electronic Components; ORDERING-CODE: ERJ-1GE0R00C; VARIANTS: !efficient-power
R15 = firefly:R-US_: RESISTOR, American symbol; MANUFACTURER: Yageo; ORDERING-CODE: RC0201FR-07100KL; VARIANTS: usb-charging
R27 R28 = firefly:R-US_: RESISTOR, American symbol; MANUFACTURER: Panasonic Electronic Components; ORDERING-CODE: ERJ-1GEF15R0C; VARIANTS: usb-data
U1 = firefly:EFM32LG330F256: EFM32LG330F256 Leopard Microcontroller in 9mm x 9mm QFN64 package; MANUFACTURER: Energy Micro; ORDERING-CODE: EFM32LG330F256
U2 = firefly:NRF8001; DISTRIBUTOR: Mouser; MANUFACTURER: Nordic Semiconductor; ORDERING-CODE: nRF8001-R2Q32-T
U3 = firefly:LIS3DH; MANUFACTURER: ST; ORDERING-CODE: LIS3DHTR
U4 = firefly:MAG3110; MANUFACTURER: Freescale Semiconductor; ORDERING-CODE: MAG3110FCR1
U5 = firefly:TCA6507; MANUFACTURER: ROHM Semiconductor; ORDERING-CODE: TCA6507RUER
U6 = firefly:MOSFET-N+P; MANUFACTURER: Diodes Inc; ORDERING-CODE: DMC2990UDJ-7
U7 = firefly:MCP73832; DISTRIBUTOR: Mouser; MANUFACTURER: Microchip; ORDERING-CODE: MCP73832-2ACI/MC; VARIANTS: usb-charging
U8 U9 = firefly:FPF100X; MANUFACTURER: Fairchild Semiconductor; ORDERING-CODE: FPF1005; VARIANTS: low-power
U10 = firefly:USB-ESD; MANUFACTURER: STMicroelectronics; ORDERING-CODE: USBULC6-2M6; VARIANTS: usb-data
U11 = firefly:TPS782XX; MANUFACTURER: Texas Instruments; ORDERING-CODE: TPS78222DRVR
U12 = firefly:TPS6208X; MANUFACTURER: Texas Instruments; ORDERING-CODE: TPS62080ADSGT; VARIANTS: efficient-power
U13 = firefly:NX3L1T53; MANUFACTURER: NXP Semiconductor; ORDERING-CODE: NX3L1T53GM,125; VARIANTS: efficient-power
U14 = firefly:FDFMA2P029Z; MANUFACTURER: Fairchild Semiconductor; ORDERING-CODE: FDFMA2P029Z; VARIANTS: usb-power
U15 = firefly:MEMORY-I2C; MANUFACTURER: Atmel; ORDERING-CODE: AT24C512C-MAHM-T
X1 X3 = firefly:XTAL2; MANUFACTURER: TXC CORPORATION; ORDERING-CODE: 9HT10-32.768KEZF-T
X2 = firefly:XTAL; MANUFACTURER: TXC CORPORATION; ORDERING-CODE: 7V-16.000MAAE-T
X4 = firefly:XTAL; MANUFACTURER: Abracon Corporation; ORDERING-CODE: ABM11-48.000MHZ-D2X-T3; VARIANTS: usb-data